# Altium schematic sheet extBoard_sheet3_interrupt_generator.SchDoc: EXT BOARD - Interrupt Generator
size A4; Revision: 0.1.0; SheetNumber: 3; SheetTotal: 5; Author: NALO; DrawnBy: NALO; DocumentSize: A4; PCAName: EXT BOARD; ProjectName: Bachelor's Thesis
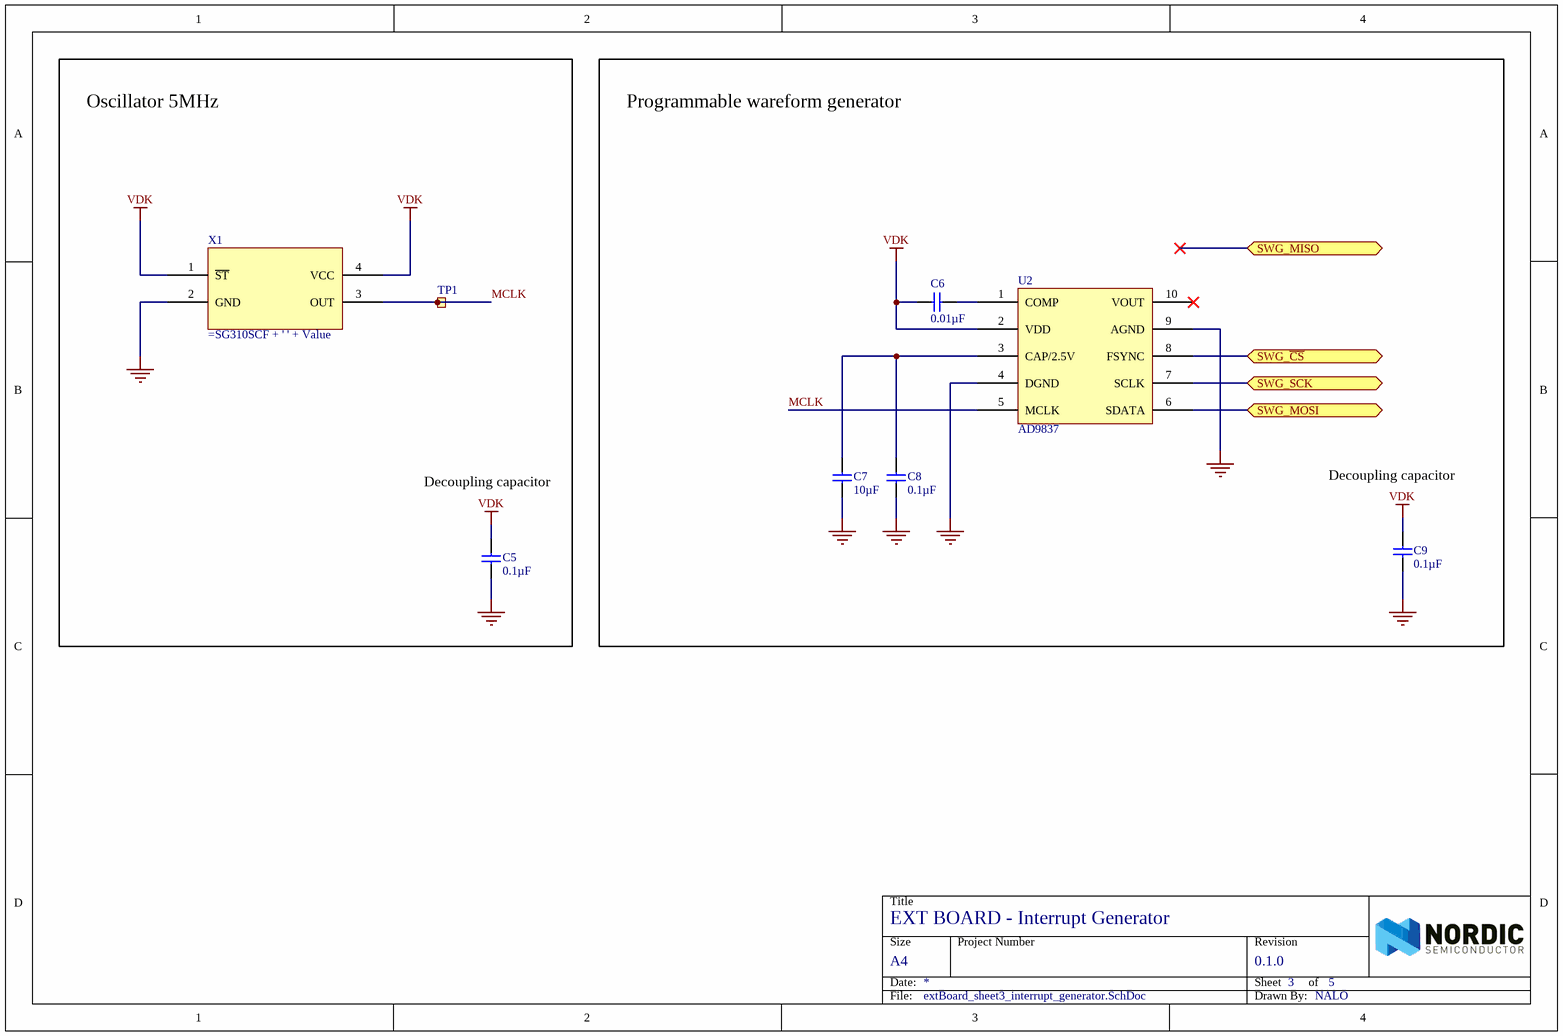
[diagram p0: extBoard_sheet3_interrupt_generator.SchDoc]

## Parts
C5  0.1µF  [CAPC2012X11L]
C6  0.01µF  [CAPC2012X11L]
C7  10µF  [CAPC2012X11L]
C8  0.1µF  [CAPC2012X11L]
C9  0.1µF  [CAPC2012X11L]
TP1  TP  [TESTPAD-TH]  (value not drawn)  (no BOM)
U2  AD9837  [DFN50P300X300X95-10N]
X1  (no value)  [SG310SCF]

## Blocks framed on the sheet
Oscillator 5MHz: C5 TP1 X1
Programmable wareform generator: C6-C9 U2

## Ports
SWG_MISO (bidir), SWG_MOSI (bidir), SWG_SCK (bidir), SWG_~{CS} (bidir)

## Nets
GND: C5.1 C7.1 C8.1 C9.1 U2.4(DGND) U2.9(AGND) X1.2(GND)
VDK: C5.2 C6.2 C9.2 U2.2(VDD) X1.1(~{ST}) X1.4(VCC)
MCLK: TP1.1 U2.5(MCLK) X1.3(OUT)
SWG_~{CS}: U2.8(FSYNC) ; port SWG_~{CS}
SWG_MOSI: U2.6(SDATA) ; port SWG_MOSI
SWG_SCK: U2.7(SCLK) ; port SWG_SCK
NetC6_1: C6.1 U2.1(COMP)
NetC7_2: C7.2 C8.2 U2.3(CAP/2.5V)

Not connected (* = marked no-connect by the designer): U2 10(VOUT)*

## Notes on the sheet
- Decoupling capacitor
- Title
- Size
- Date:
- Project Number
- Sheet         of
- Revision
- File:
- Drawn By:

## Library data of the parts
C5-C9 = CAP_0805: Capacitor, X5R, ±10%; Part Number: C0805-4µ7; Note: 16V; Artikkelnr Noca: 20039266; Artikkelnr Simpro: N.A.; Manufacturer: *; Manufacturer Part Number: *; Datasheet: *; Footprint Doc: 0805; LatestRevisionDate: 2013-06-04; Pin Count: 2; Publisher: Nordic Semiconductor; Published: 2009-08-21; Supplier: *; Supplier part number: *; 2nd source Supplier: *; 2nd source part number: *
  C5 C8 C9: Value: 0.1µF
  C6: Value: 0.01µF
  C7: Value: 10µF
TP1 = Testpoint TH: Testpoint, through hole; Artikkelnr Noca: N.A.; Part Number: Testpoint TH; Manufacturer: *; Manufacturer Part Number: *; Datasheet: *; Footprint Doc: TESTPAD-TH; LatestRevisionDate: 2009-12-12; Pin Count: 1; Publisher: Nordic Semiconductor; Published: 2009-12-12; Value: TP; Note: *; Supplier: *; Supplier part number: *; 2nd source Supplier: *; 2nd source part number: *; Artikkelnr Simpro: N.A.
X1 = SG310SCF: Value: 16MHz